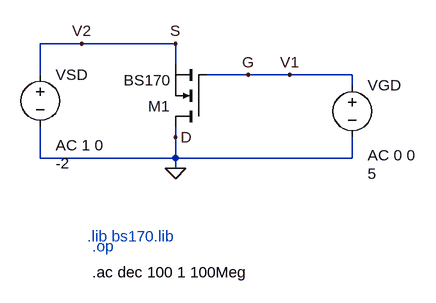
[diagram p0: schematic circuito_bs170.asc]
circuito_bs170.asc, the LTspice schematic file:
Version 4.1
SHEET 1 880 680
WIRE -336 96 -400 96
WIRE -192 96 -336 96
WIRE -192 128 -192 96
WIRE -400 144 -400 96
WIRE -80 144 -144 144
WIRE -16 144 -80 144
WIRE 80 144 -16 144
WIRE 80 160 80 144
WIRE -192 240 -192 224
WIRE -400 272 -400 224
WIRE -192 272 -192 240
WIRE -192 272 -400 272
WIRE 80 272 80 240
WIRE 80 272 -192 272
WIRE -192 288 -192 272
FLAG -80 144 G
FLAG -192 240 D
FLAG -192 96 S
FLAG -192 288 0
FLAG -336 96 V2
FLAG -16 144 V1
SYMBOL nmos -144 224 R180
SYMATTR InstName M1
SYMATTR Value BS170
SYMBOL voltage 80 144 R0
WINDOW 3 24 152 Left 2
WINDOW 123 24 124 Left 2
WINDOW 39 0 0 Left 0
SYMATTR InstName VGD
SYMATTR Value 5
SYMATTR Value2 AC 0 0
SYMBOL voltage -400 128 R0
WINDOW 3 24 152 Left 2
WINDOW 123 24 124 Left 2
WINDOW 39 0 0 Left 0
SYMATTR InstName VSD
SYMATTR Value -2
SYMATTR Value2 AC 1 0
TEXT -328 392 Left 2 ;.lib bs170.lib
TEXT -320 408 Left 2 ;.op
TEXT -320 448 Left 2 !.ac dec 100 1 100Meg

The netlist it stands for:
* circuito_bs170.asc
M1 0 V1 V2 V2 BS170
VGD V1 0 5 AC 0 0
VSD V2 0 -2 AC 1 0
.model NMOS NMOS
.model PMOS PMOS
.lib standard.mos
* .lib bs170.lib
* .op
.ac dec 100 1 100Meg
.backanno
.end